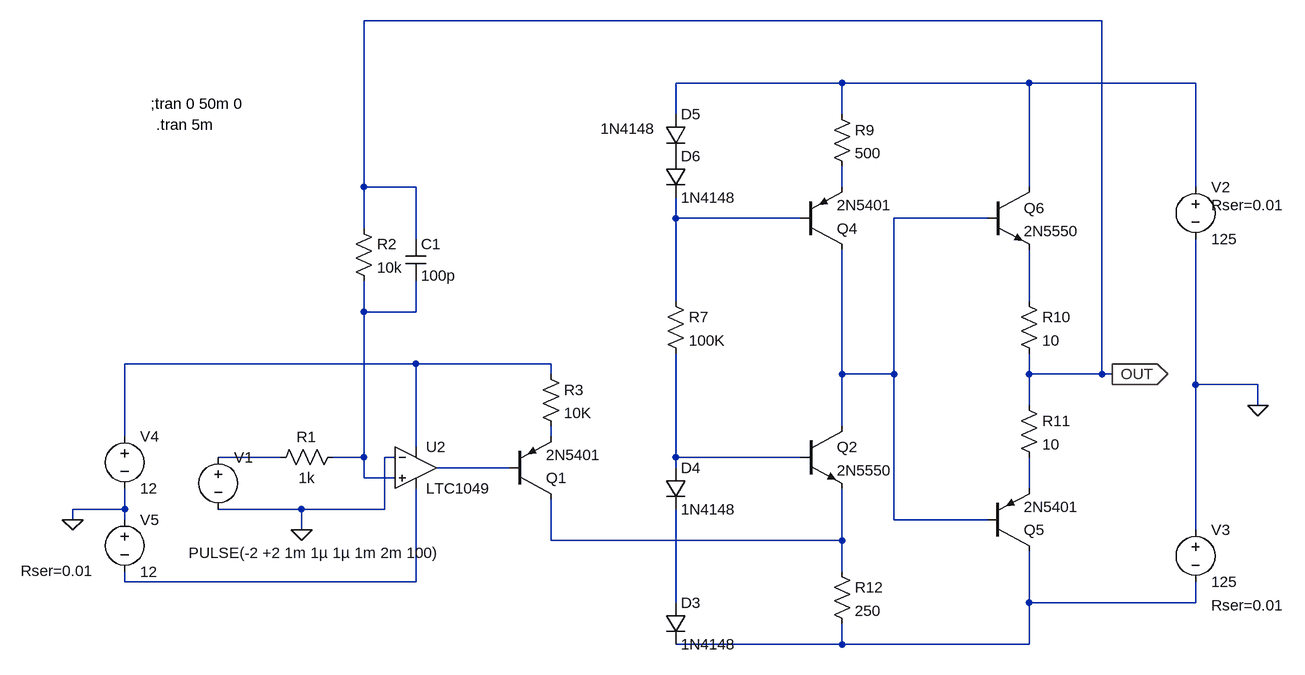
[diagram p0: schematic HVOpAmp1.asc]
HVOpAmp1.asc, the LTspice schematic file:
Version 4
SHEET 1 2500 2968
WIRE 1200 -512 64 -512
WIRE 800 -416 544 -416
WIRE 1088 -416 800 -416
WIRE 1344 -416 1088 -416
WIRE 544 -368 544 -416
WIRE 800 -368 800 -416
WIRE 64 -256 64 -512
WIRE 144 -256 64 -256
WIRE 800 -256 800 -288
WIRE 1088 -256 1088 -416
WIRE 1344 -256 1344 -416
WIRE 544 -208 544 -240
WIRE 736 -208 544 -208
WIRE 1024 -208 880 -208
WIRE 64 -192 64 -256
WIRE 144 -176 144 -256
WIRE 544 -80 544 -208
WIRE 1088 -80 1088 -160
WIRE 64 -64 64 -112
WIRE 144 -64 144 -112
WIRE 144 -64 64 -64
WIRE 144 16 -304 16
WIRE 352 16 144 16
WIRE 352 32 352 16
WIRE 800 32 800 -160
WIRE 880 32 880 -208
WIRE 880 32 800 32
WIRE 1088 32 1088 0
WIRE 1200 32 1200 -512
WIRE 1200 32 1088 32
WIRE 1216 32 1200 32
WIRE 1344 48 1344 -176
WIRE 1440 48 1344 48
WIRE 1088 80 1088 32
WIRE 1440 80 1440 48
WIRE 800 112 800 32
WIRE -304 128 -304 16
WIRE 352 128 352 112
WIRE 144 144 144 16
WIRE -64 160 -160 160
WIRE 64 160 64 -64
WIRE 64 160 16 160
WIRE 112 160 96 160
WIRE 544 160 544 0
WIRE 736 160 544 160
WIRE 288 176 176 176
WIRE 544 176 544 160
WIRE 64 192 64 160
WIRE 112 192 64 192
WIRE 1088 208 1088 160
WIRE -304 240 -304 208
WIRE -304 240 -384 240
WIRE -32 240 -160 240
WIRE 96 240 96 160
WIRE 96 240 -32 240
WIRE -384 256 -384 240
WIRE -304 256 -304 240
WIRE 880 256 880 32
WIRE 1024 256 880 256
WIRE -32 272 -32 240
WIRE 1344 272 1344 48
WIRE 352 288 352 224
WIRE 800 288 800 208
WIRE 800 288 352 288
WIRE 800 336 800 288
WIRE -304 352 -304 336
WIRE 144 352 144 208
WIRE 144 352 -304 352
WIRE 544 384 544 240
WIRE 1088 384 1088 304
WIRE 1344 384 1344 352
WIRE 1344 384 1088 384
WIRE 800 448 800 416
WIRE 800 448 544 448
WIRE 1088 448 1088 384
WIRE 1088 448 800 448
FLAG -32 272 0
FLAG 1440 80 0
FLAG -384 256 0
FLAG 1216 32 OUT
IOPIN 1216 32 Out
SYMBOL res 32 144 R90
WINDOW 0 0 56 VBottom 2
WINDOW 3 32 56 VTop 2
SYMATTR InstName R1
SYMATTR Value 1k
SYMBOL res 48 -208 R0
SYMATTR InstName R2
SYMATTR Value 10k
SYMBOL pnp 288 224 M180
SYMATTR InstName Q1
SYMATTR Value 2N5401
SYMBOL npn 736 112 R0
SYMATTR InstName Q2
SYMATTR Value 2N5550
SYMBOL res 528 -96 R0
SYMATTR InstName R7
SYMATTR Value 100K
SYMBOL pnp 736 -160 M180
SYMATTR InstName Q4
SYMATTR Value 2N5401
SYMBOL pnp 1024 304 M180
SYMATTR InstName Q5
SYMATTR Value 2N5401
SYMBOL npn 1024 -256 R0
SYMATTR InstName Q6
SYMATTR Value 2N5550
SYMBOL voltage 1344 -272 R0
WINDOW 123 0 0 Left 2
WINDOW 39 24 44 Left 2
SYMATTR SpiceLine Rser=0.01
SYMATTR InstName V2
SYMATTR Value 125
SYMBOL voltage 1344 256 R0
WINDOW 123 0 0 Left 2
WINDOW 39 24 132 Left 2
SYMATTR SpiceLine Rser=0.01
SYMATTR InstName V3
SYMATTR Value 125
SYMBOL voltage -304 112 R0
WINDOW 123 0 0 Left 2
WINDOW 39 -160 223 Left 2
SYMATTR SpiceLine Rser=0.01
SYMATTR InstName V4
SYMATTR Value 12
SYMBOL voltage -304 240 R0
SYMATTR SpiceLine Rser=0.01
SYMATTR InstName V5
SYMATTR Value 12
SYMBOL res 784 -384 R0
SYMATTR InstName R9
SYMATTR Value 500
SYMBOL res 1072 -96 R0
SYMATTR InstName R10
SYMATTR Value 10
SYMBOL res 1072 64 R0
SYMATTR InstName R11
SYMATTR Value 10
SYMBOL res 784 320 R0
SYMATTR InstName R12
SYMATTR Value 250
SYMBOL diode 528 384 R0
SYMATTR InstName D3
SYMATTR Value 1N4148
SYMBOL diode 528 176 R0
SYMATTR InstName D4
SYMATTR Value 1N4148
SYMBOL diode 528 -368 R0
WINDOW 3 -100 22 Left 2
SYMATTR InstName D5
SYMATTR Value 1N4148
SYMBOL diode 528 -304 R0
SYMATTR InstName D6
SYMATTR Value 1N4148
SYMBOL Opamps\\LTC1049 144 112 R0
SYMATTR InstName U2
SYMBOL res 336 16 R0
SYMATTR InstName R3
SYMATTR Value 10K
SYMBOL voltage -160 144 R0
WINDOW 123 0 0 Left 2
WINDOW 39 0 0 Left 2
WINDOW 3 -46 163 Left 2
SYMATTR InstName V1
SYMATTR Value PULSE(-2 +2 1m 1µ 1µ 1m 2m 100)
SYMBOL cap 128 -176 R0
SYMATTR InstName C1
SYMATTR Value 100p
TEXT -264 -384 Left 2 !;tran 0 50m 0
TEXT -256 -352 Left 2 !.tran 5m

The netlist it stands for:
* HVOpAmp1.asc
R1 N006 N009 1k
R2 OUT N006 10k
Q1 N013 N011 N008 0 2N5401
Q2 N004 N010 N013 0 2N5550
R7 N003 N010 100K
Q4 N004 N003 N002 0 2N5401
Q5 N016 N004 N012 0 2N5401
Q6 N001 N004 N005 0 2N5550
V2 N001 0 125 Rser=0.01
V3 0 N016 125 Rser=0.01
V4 N007 0 12 Rser=0.01
V5 0 N014 12 Rser=0.01
R9 N001 N002 500
R10 N005 OUT 10
R11 OUT N012 10
R12 N013 N016 250
D3 N015 N016 1N4148
D4 N010 N015 1N4148
D5 N001 P001 1N4148
D6 P001 N003 1N4148
XU2 N006 0 N007 N014 N011 LTC1049  ; pins In+ In- V+ V- OUT
R3 N007 N008 10K
V1 N009 0 PULSE(-2 +2 1m 1µ 1µ 1m 2m 100)
C1 OUT N006 100p
.model D D
.lib standard.dio
.model NPN NPN
.model PNP PNP
.lib standard.bjt
;tran 0 50m 0
.tran 5m
.backanno
.end